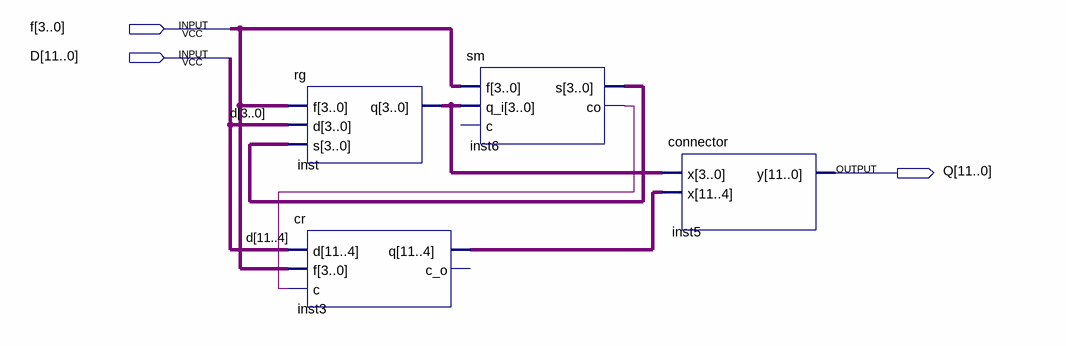
[diagram p0: schematic sheet]
// Quartus schematic l1.bdf as structural Verilog: 4 symbols, 3 pins
module l1 (
  input  [3:0] f,
  input  [11:0] D,
  output [11:0] Q
);

  wire inst6_co;
  wire [3:0] inst6_s, inst_q;
  wire [7:0] inst3_q;

  rg inst (.f(f), .d(D[3:0]), .s(inst6_s), .q(inst_q));
  cr inst3 (.d(D[11:4]), .f(f), .c(inst6_co), .q(inst3_q));  // open: c_o
  sm inst6 (.f(f), .q_i(inst_q), .s(inst6_s), .co(inst6_co));  // open: c
  connector inst5 (.x({inst3_q, inst_q}), .y(Q));
endmodule
